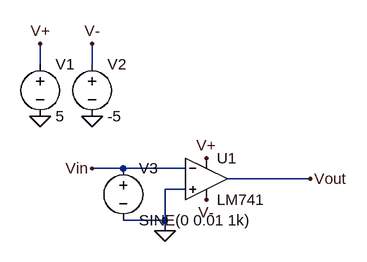
[diagram p0: schematic 5.1.asc]
5.1.asc, the LTspice schematic file:
Version 4.1
SHEET 1 880 680
WIRE -64 -16 -64 -48
WIRE 16 -16 16 -48
WIRE 64 144 16 144
WIRE 160 144 64 144
WIRE 352 160 224 160
WIRE 160 176 128 176
WIRE 128 224 128 176
WIRE 128 224 64 224
WIRE 128 240 128 224
FLAG -64 64 0
FLAG 16 64 0
FLAG 128 240 0
FLAG -64 -48 V+
FLAG 16 -48 V-
FLAG 192 192 V-
FLAG 192 128 V+
FLAG 352 160 Vout
FLAG 16 144 Vin
SYMBOL OpAmps\\LM741 192 96 R0
SYMATTR InstName U1
SYMBOL voltage -64 -32 R0
WINDOW 123 0 0 Left 0
WINDOW 39 0 0 Left 0
SYMATTR InstName V1
SYMATTR Value 5
SYMBOL voltage 16 -32 R0
WINDOW 123 0 0 Left 0
WINDOW 39 0 0 Left 0
SYMATTR InstName V2
SYMATTR Value -5
SYMBOL voltage 64 128 R0
WINDOW 123 0 0 Left 0
WINDOW 39 0 0 Left 0
SYMATTR InstName V3
SYMATTR Value SINE(0 0.01 1k)

The netlist it stands for:
* 5.1.asc
X§U1 0 Vin V+ V- Vout LM741  ; pins In+ In- V+ V- OUT
V1 V+ 0 5
V2 V- 0 -5
V3 Vin 0 SINE(0 0.01 1k)
.lib LM741.lib
.backanno
.end